# EAGLE design weather-bit (EAGLE 9.5.1)
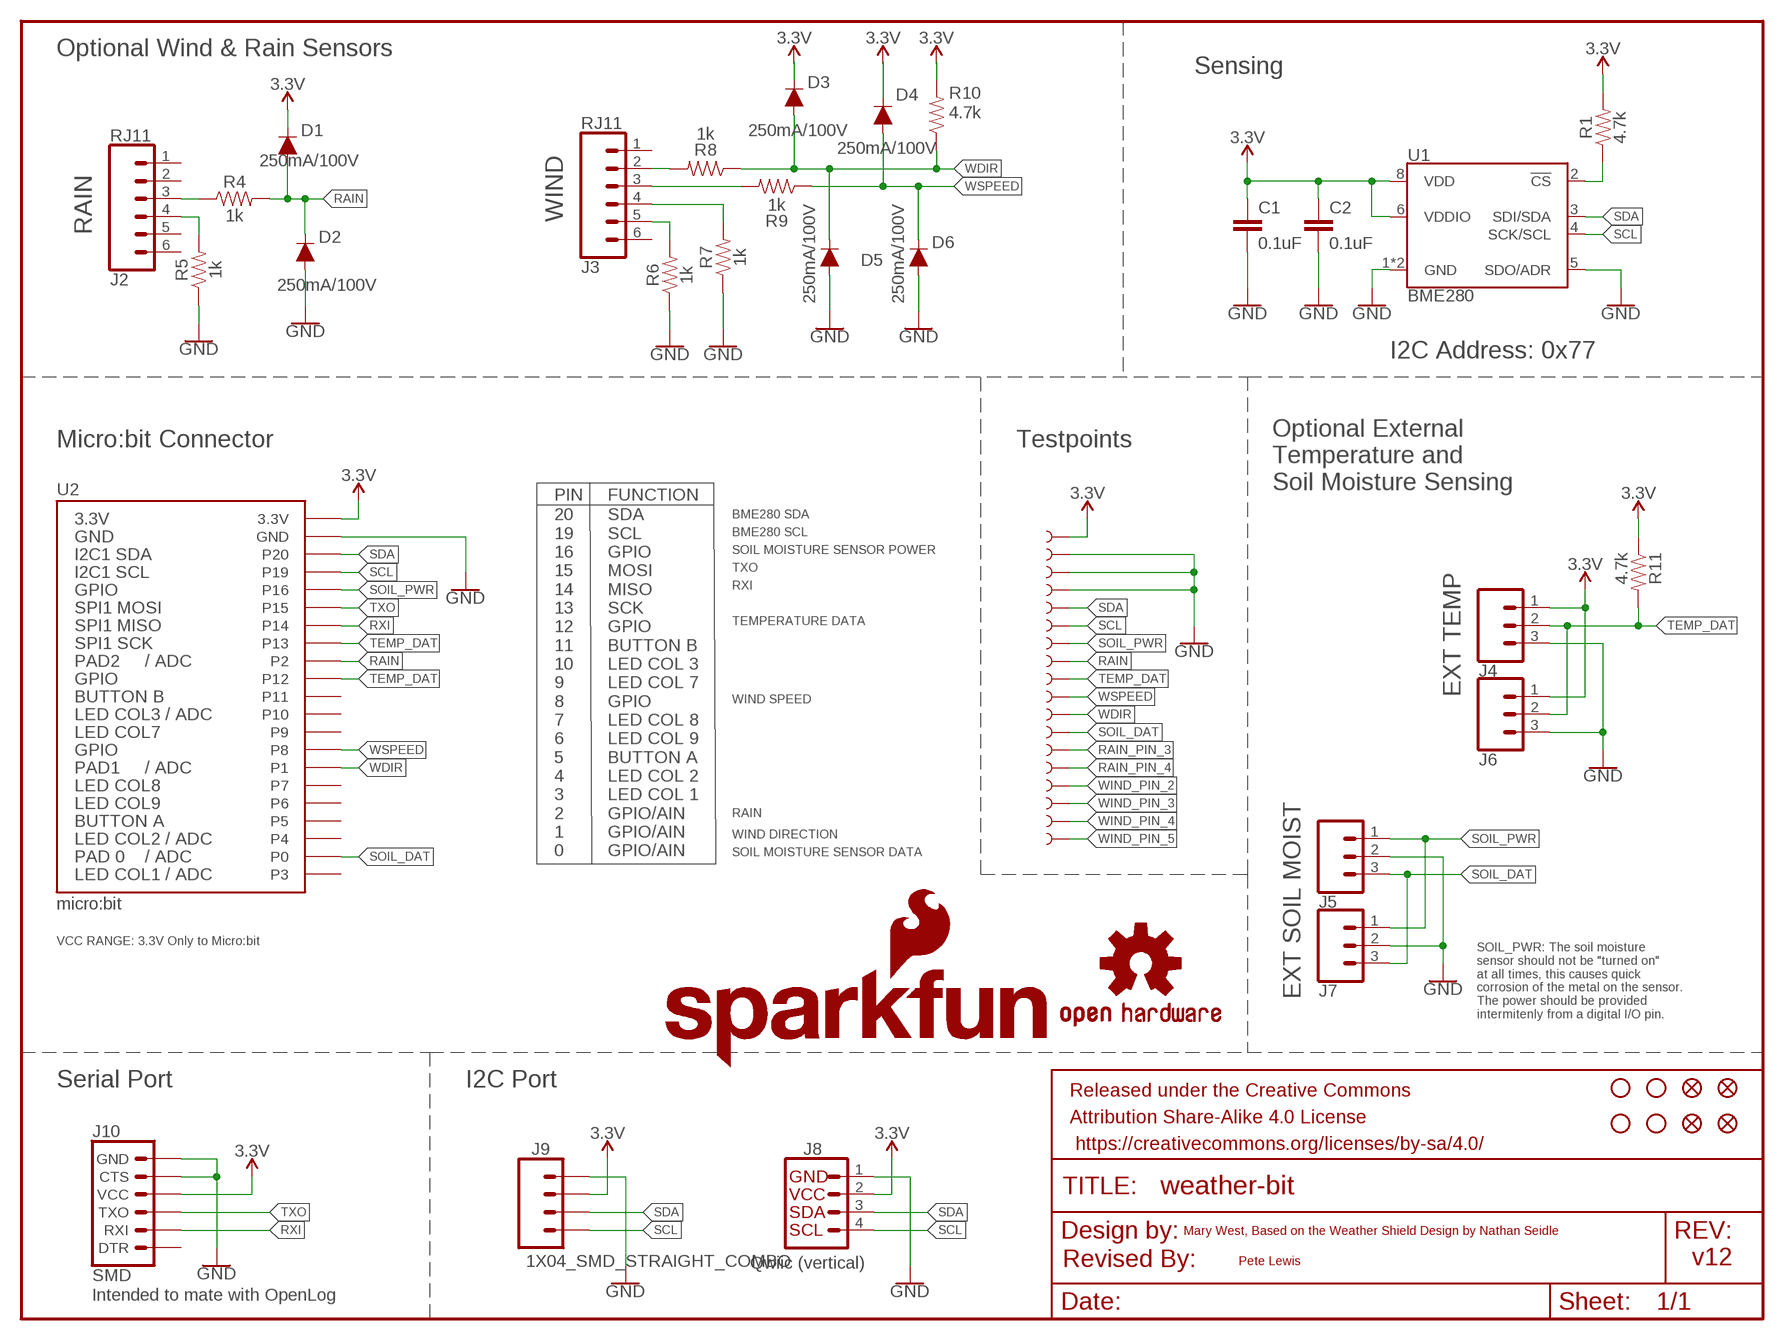
[diagram p0: schematic, sheet 1]

## Parts
C1  0.1uF  0.1UF-0603-25V-(+80/-20%)  [0603]
C2  0.1uF  0.1UF-0603-25V-(+80/-20%)  [0603]
D1  250mA/100V  DIODE-BAS16J  [SOD-323]
D2  250mA/100V  DIODE-BAS16J  [SOD-323]
D3  250mA/100V  DIODE-BAS16J  [SOD-323]
D4  250mA/100V  DIODE-BAS16J  [SOD-323]
D5  250mA/100V  DIODE-BAS16J  [SOD-323]
D6  250mA/100V  DIODE-BAS16J  [SOD-323]
FD1  FIDUCIAL1X2  [FIDUCIAL-1X2]
FD2  FIDUCIAL1X2  [FIDUCIAL-1X2]
FD3  FIDUCIAL1X2  [FIDUCIAL-1X2]
FD4  FIDUCIAL1X2  [FIDUCIAL-1X2]
FRAME1  FRAME-LETTER  [CREATIVE_COMMONS]
H1  STAND-OFF  [STAND-OFF]
H2  STAND-OFF  [STAND-OFF]
H3  STAND-OFF  [STAND-OFF]
H4  STAND-OFF  [STAND-OFF]
J2  RJ11  RJ11-6  [RJ11-6]
J3  RJ11  RJ11-6  [RJ11-6]
J4  CONN_03SCREW_LOCK  [SCREWTERMINAL-3.5MM-3_LOCK.007S]
J5  CONN_03SCREW_LOCK  [SCREWTERMINAL-3.5MM-3_LOCK.007S]
J6  CONN_03  [1X03]
J7  CONN_03  [1X03]
J8  Qwiic (vertical)  QWIIC_CONNECTOR  [JST04_1MM_VERT]
J9  1X04_SMD_STRAIGHT_COMBO  CONN_04SMD_STRAIGHT_COMBO  [1X04_SMD_VERTICAL_COMBO]
J10  SMD  6_PIN_SERIAL_TARGETVERT_SMT  [6_PIN_SERIAL_TARGET_SIDE_VERT_SMT]
LOGO2  SFE_LOGO_NAME_FLAME.3_INCH  [SFE_LOGO_NAME_FLAME_.3]
LOGO3  OSHW-LOGOL  [OSHW-LOGO-L]
R1  4.7k  4.7KOHM-0603-1/10W-1%  [0603]
R4  1k  1KOHM-0603-1/10W-1%  [0603]
R5  1k  1KOHM-0603-1/10W-1%  [0603]
R6  1k  1KOHM-0603-1/10W-1%  [0603]
R7  1k  1KOHM-0603-1/10W-1%  [0603]
R8  1k  1KOHM-0603-1/10W-1%  [0603]
R9  1k  1KOHM-0603-1/10W-1%  [0603]
R10  4.7k  4.7KOHM-0603-1/10W-1%  [0603]
R11  4.7k  4.7KOHM-0603-1/10W-1%  [0603]
TP1  TEST-POINTTP_15TH_THRU  [TP_15TH]
TP2  TEST-POINTTP_15TH_THRU  [TP_15TH]
TP3  TEST-POINTTP_15TH_THRU  [TP_15TH]
TP4  TEST-POINTTP_15TH_THRU  [TP_15TH]
TP5  TEST-POINTTP_15TH_THRU  [TP_15TH]
TP6  TEST-POINT3X4  [PAD.03X.04]
TP7  TEST-POINT3X4  [PAD.03X.04]
TP8  TEST-POINTTP_15TH_THRU  [TP_15TH]
TP9  TEST-POINTTP_15TH_THRU  [TP_15TH]
TP10  TEST-POINT3X4  [PAD.03X.04]
TP11  TEST-POINT3X4  [PAD.03X.04]
TP12  TEST-POINT3X4  [PAD.03X.04]
TP13  TEST-POINTTP_15TH_THRU  [TP_15TH]
TP14  TEST-POINTTP_15TH_THRU  [TP_15TH]
TP15  TEST-POINT3X4  [PAD.03X.04]
TP16  TEST-POINTTP_15TH_THRU  [TP_15TH]
TP17  TEST-POINTTP_15TH_THRU  [TP_15TH]
TP19  TEST-POINTTP_15TH_THRU  [TP_15TH]
U1  BME280  [LGA-8-2.5X2.5]
U2  micro:bit  MICRO:BIT_RA  [MICRO:BIT-RA_SMD]

## Nets
3.3V: C1.1 C2.1 D1.C D3.C D4.C J4.1 J6.1 J8.2 J9.3 J9.3-2 J10.4(VCC) J10.4-2(VCC) R1.2 R10.2 R11.1 TP1.P$1 U1.6(VDDIO) U1.8(VDD) U2.P$27(3.3V) U2.P$28(3.3V) U2.P$29(3.3V) U2.P$30(3.3V) U2.P$31(3.3V) U2.P$32(3.3V)
GND: C1.2 C2.2 D2.A D5.A D6.A J4.3 J5.2 J6.3 J7.2 J8.1 J9.4 J9.4-2 J10.5(CTS) J10.5-2(CTS) J10.6(GND) J10.6-2(GND) R5.1 R6.1 R7.1 TP2.P$1 TP16.P$1 TP17.P$1 U1.1(GND) U1.5(SDO/ADR) U1.7(GND) U2.P$35(GND) U2.P$36(GND) U2.P$37(GND) U2.P$38(GND) U2.P$39(GND) U2.P$40(GND)
N$2: R1.1 U1.2(!CS)
RAIN: D1.A D2.C R4.2 TP8.P$1 U2.P$19(P2) U2.P$20(P2) U2.P$21(P2) U2.P$22(P2)
RAIN_PIN_3: J2.3 R4.1 TP6.P$1
RAIN_PIN_4: J2.4 R5.2 TP7.P$1
RXI: J10.3(RXI) J10.3-2(RXI) U2.P$24(P14)
SCL: J8.4 J9.1 J9.1-2 TP4.P$1 U1.4(SCK/SCL) U2.P$33(P19)
SDA: J8.3 J9.2 J9.2-2 TP3.P$1 U1.3(SDI/SDA) U2.P$34(P20)
SOIL_DAT: J5.3 J7.3 TP19.P$1 U2.P$2(P0) U2.P$3(P0) U2.P$4(P0) U2.P$5(P0)
SOIL_PWR: J5.1 J7.1 TP5.P$1 U2.P$26(P16)
TEMP_DAT: J4.2 J6.2 R11.2 TP9.P$1 U2.P$18(P12) U2.P$23(P13)
TXO: J10.2(TXO) J10.2-2(TXO) U2.P$25(P15)
WDIR: D3.A D5.C R8.1 R10.1 TP14.P$1 U2.P$10(P1) U2.P$11(P1) U2.P$12(P1) U2.P$13(P1)
WIND_PIN_2: J3.2 R8.2 TP10.P$1
WIND_PIN_3: J3.3 R9.2 TP11.P$1
WIND_PIN_4: J3.4 R7.2 TP12.P$1
WIND_PIN_5: J3.5 R6.2 TP15.P$1
WSPEED: D4.A D6.C R9.1 TP13.P$1 U2.P$14(P8)
Unconnected: J2.1 J2.2 J2.5 J2.6 J3.1 J3.6 J10.1(DTR) J10.1-2(DTR) U2.P$1(P3) U2.P$6(P4) U2.P$7(P5) U2.P$8(P6) U2.P$9(P7) U2.P$15(P9) U2.P$16(P10) U2.P$17(P11)

## Notes on the sheet
- Optional Wind & Rain Sensors
- Sensing
- WIND
- RAIN
- I2C Address: 0x77
- Optional External 
  Temperature and 
  Soil Moisture Sensing
- Micro:bit Connector | Testpoints
- PIN | FUNCTION
- BME280 SDA
- BME280 SCL
- SOIL MOISTURE SENSOR POWER
- TXO
- RXI
- TEMPERATURE DATA
- EXT TEMP
- WIND SPEED
- RAIN
- WIND DIRECTION
- 20
  19
  16
  15
  14
  13
  12
  11
  10
  9
  8
  7
  6
  5
  4
  3
  2
  1
  0
- SDA
  SCL
  GPIO
  MOSI
  MISO
  SCK
  GPIO
  BUTTON B
  LED COL 3
  LED COL 7
  GPIO
  LED COL 8
  LED COL 9
  BUTTON A
  LED COL 2
  LED COL 1
  GPIO/AIN
  GPIO/AIN
  GPIO/AIN
- SOIL MOISTURE SENSOR DATA
- VCC RANGE: 3.3V Only to Micro:bit
- EXT SOIL MOIST
- SOIL_PWR: The soil moisture
  sensor should not be "turned on" 
  at all times, this causes quick
  corrosion of the metal on the sensor.
  The power should be provided 
  intermitenly from a digital I/O pin.
- Serial Port | I2C Port
- Mary West, Based on the Weather Shield Design by Nathan Seidle
- Revised By: | Pete Lewis | v12
- Intended to mate with OpenLog

## Library data of the parts
C1 C2 = SparkFun-Capacitors:0.1UF: 0.1µF ceramic capacitors A capacitor is a passive two-terminal electrical component used to store electrical energy temporarily in an electric field.; PROD_ID: CAP-00810
D1-D6 = SparkFun-DiscreteSemi:DIODE: Diode These are standard reverse protection diodes and small signal diodes. SparkFun Products: SparkFun SparkPunk Sound Kit <https://www.sparkfun.com/products/11177> SparkFun ESP8266 Thing <https://www.sparkfun.com/products/13231>; PROD_ID: DIO-09646
FD1-FD4 = SparkFun-Aesthetics:FIDUCIAL: Fiducial Alignment Points Point-of-reference for pick-and-place machines and other optical instruments.
FRAME1 = SparkFun-Aesthetics:FRAME-LETTER: Schematic Frame - Letter Standard 8.5x11 US Letter frame
H1-H4 = SparkFun-Electromechanical:STAND-OFF: #4 Stand Off This is the mechanical footprint for a #4 phillips button head screw. Use the keepout ring to avoid running the screw head into surrounding components. SKU : PRT-00447
J2 J3 = SparkFun-Connectors:RJ11-6: RJ11 Jack - 6 pin Commonly found on CAT3 devices and some Microchip programmers. Here is the connector we sell at SparkFun: RJ11 6-Pin Connector <https://www.sparkfun.com/products/132> (PRT-00132) Datasheet <http://www.sparkfun.com/datasheets/Prototyping/Connectors/RJ11-Datasheet.pdf> It is used on this SparkFun product: SparkFun Weather Shield <https://www.sparkfun.com/products/12081> (DEV-12081) Weather Meters <https://www.sparkfun.com/products/8942> (SEN-08942); PROD_ID: CONN-08590; SF_ID: PRT-00132
J4 J5 = SparkFun-Connectors:CONN_03: Multi connection point. Often used as Generic Header-pin footprint for 0.1 inch spaced/style header connections On any of the 0.1 inch spaced packages, you can populate with these: Break Away Headers - Straight <https://www.sparkfun.com/products/116> (PRT-00116) Break Away Male Headers - Right Angle <https://www.sparkfun.com/products/553> (PRT-00553) Female Headers <https://www.sparkfun.com/products/115> (PRT-00115) Break Away Headers - Machine Pin <https://www.sparkfun.com/products/117> (PRT-00117) Break Away Female Headers - Swiss Machine Pin <https://www.sparkfun.com/products/743> (PRT-00743) Stackable Header - 3 Pin (Female, 0.1") <https://www.sparkfun.com/products/13875> (PRT-13875) For SCREWTERMINALS and SPRING TERMINALS visit here: Screw Terimnals on SparkFun.com <https://www.sparkfun.com/search/results?term=Screw+Terminals> (5mm/3.5mm/2.54mm spacing) This device is also useful as a general connection point to wire up your design to another part of your project. Our various solder wires solder well into these plated through hole pads. Hook-Up Wire - Assortment (Stranded, 22 AWG) <https://www.sparkfun.com/products/11375> (PRT-11375) Hook-Up Wire - Assortment (Solid Core, 22 AWG) <https://www.sparkfun.com/products/11367> (PRT-11367) View the entire wire category on our website here <https://www.sparkfun.com/categories/141> Special notes: Molex polarized connector foot print use with SKU : PRT-08232 with associated crimp pins and housings.; PROD_ID: CONN-08288; SF_ID: PRT-08235
J6 J7 = SparkFun-Connectors:CONN_03: Multi connection point. Often used as Generic Header-pin footprint for 0.1 inch spaced/style header connections On any of the 0.1 inch spaced packages, you can populate with these: Break Away Headers - Straight <https://www.sparkfun.com/products/116> (PRT-00116) Break Away Male Headers - Right Angle <https://www.sparkfun.com/products/553> (PRT-00553) Female Headers <https://www.sparkfun.com/products/115> (PRT-00115) Break Away Headers - Machine Pin <https://www.sparkfun.com/products/117> (PRT-00117) Break Away Female Headers - Swiss Machine Pin <https://www.sparkfun.com/products/743> (PRT-00743) Stackable Header - 3 Pin (Female, 0.1") <https://www.sparkfun.com/products/13875> (PRT-13875) For SCREWTERMINALS and SPRING TERMINALS visit here: Screw Terimnals on SparkFun.com <https://www.sparkfun.com/search/results?term=Screw+Terminals> (5mm/3.5mm/2.54mm spacing) This device is also useful as a general connection point to wire up your design to another part of your project. Our various solder wires solder well into these plated through hole pads. Hook-Up Wire - Assortment (Stranded, 22 AWG) <https://www.sparkfun.com/products/11375> (PRT-11375) Hook-Up Wire - Assortment (Solid Core, 22 AWG) <https://www.sparkfun.com/products/11367> (PRT-11367) View the entire wire category on our website here <https://www.sparkfun.com/categories/141> Special notes: Molex polarized connector foot print use with SKU : PRT-08232 with associated crimp pins and housings.; PROD_ID: XXX-00000; VALUE: 455-1750-1-ND
J8 = SparkFun-Connectors:QWIIC_CONNECTOR: SparkFun I2C Standard Qwiic Connector An SMD 1mm pitch JST connector makes it easy and quick (get it? Qwiic?) to connect I2C devices to each other. The Qwiic system <http://www.sparkfun.com/qwiic> enables fast and solderless connection between popular platforms and various sensors and actuators. We carry 200mm <https://www.sparkfun.com/products/14204>, 100mm <https://www.sparkfun.com/products/14205>, 50mm <https://www.sparkfun.com/products/14206>, and breadboard friendly <https://www.sparkfun.com/products/14207> Qwiic cables. We also offer 10 pcs strips <https://www.sparkfun.com/products/14323> the SMD connectors.; PROD_ID: CONN-14483; VALUE: Vertical Qwiic Connector
J9 = SparkFun-Connectors:CONN_04: Multi connection point. Often used as Generic Header-pin footprint for 0.1 inch spaced/style header connections On any of the 0.1 inch spaced packages, you can populate with these: Break Away Headers - Straight <https://www.sparkfun.com/products/116> (PRT-00116) Break Away Male Headers - Right Angle <https://www.sparkfun.com/products/553> (PRT-00553) Female Headers <https://www.sparkfun.com/products/115> (PRT-00115) Break Away Headers - Machine Pin <https://www.sparkfun.com/products/117> (PRT-00117) Break Away Female Headers - Swiss Machine Pin <https://www.sparkfun.com/products/743> (PRT-00743) For SCREWTERMINALS and SPRING TERMINALS visit here: Screw Terimnals on SparkFun.com <https://www.sparkfun.com/search/results?term=Screw+Terminals> (5mm/3.5mm/2.54mm spacing) This device is also useful as a general connection point to wire up your design to another part of your project. Our various solder wires solder well into these plated through hole pads. Hook-Up Wire - Assortment (Stranded, 22 AWG) <https://www.sparkfun.com/products/11375> (PRT-11375) Hook-Up Wire - Assortment (Solid Core, 22 AWG) <https://www.sparkfun.com/products/11367> (PRT-11367) View the entire wire category on our website here <https://www.sparkfun.com/categories/141> Special notes: Molex polarized connector foot print use with SKU : PRT-08231 with associated crimp pins and housings. 1MM SMD Version SKU: PRT-10208; PROD_ID: CONN-08511
J10 = SparkFun-Connectors:6_PIN_SERIAL_TARGET: 6-pin header connection for use with the "FTDI BASIC" pinout - TARGET SIDE. Also known as "Arduino Serial Program Header". It is used to mate with our FTDI Basic serial programmers using the Arduino IDE. Note, this device has "TARGET" in the name. It is intended to be used on a design that contains a target micro-controller that you wish to program. The "sister" device, named "CABLE" is inteneded to be used on a design that usually lives on the end of your USB cable and prvides the converter chip (FTDI232 or FTDI231x) to commnicate serial RX/TX. You can populate with some of these: Break Away Headers - Straight <https://www.sparkfun.com/products/116> (PRT-00116) For reference (or to suit your programming needs) check out these designs: SparkFun FTDI Basic Breakout - 5V <https://www.sparkfun.com/products/9716> (DEV-09716) SparkFun FTDI Basic Breakout - 3.3V <https://www.sparkfun.com/products/9873> (DEV-09873) SparkFun FTDI SmartBasic <https://www.sparkfun.com/products/12935> (DEV-12935) SparkFun Beefy 3 - FTDI Basic Breakout <https://www.sparkfun.com/products/13746> (DEV-13746); PROD_ID: CONN-10203
LOGO2 = SparkFun-Aesthetics:SFE_LOGO_NAME_FLAME: SparkFun Font Logo w/ Flame This is the SparkFun full logo. The logo on the schematic will always be the same size; the package variant is the height of the flame part of the logo. Default layer for the logo on the board is tSilk.
LOGO3 = SparkFun-Aesthetics:OSHW-LOGO: Open-Source Hardware (OSHW) Logo This logo indicates the piece of hardware it is found on incorporates a OSHW license and/or adheres to the definition of open source hardware found here: http://freedomdefined.org/OSHW
R1 R10 R11 = SparkFun-Resistors:4.7KOHM: 4.7kΩ resistor A resistor is a passive two-terminal electrical component that implements electrical resistance as a circuit element. Resistors act to reduce current flow, and, at the same time, act to lower voltage levels within circuits. - Wikipedia; PROD_ID: RES-07857
R4-R9 = SparkFun-Resistors:1KOHM: 1kΩ resistor A resistor is a passive two-terminal electrical component that implements electrical resistance as a circuit element. Resistors act to reduce current flow, and, at the same time, act to lower voltage levels within circuits. - Wikipedia; PROD_ID: RES-07856
TP1-TP17 TP19 = SparkFun-Connectors:TEST-POINT: SparkFun Test Points Bare copper test points for troubleshooting or In-Circuit-Testing. These are used by our Production team for verifying production board runs using pogo-pins on test beds. SparkFun Products: SparkFun LSM9DS1 Breakout <https://www.sparkfun.com/products/13284> SparkFun PSOC <https://www.sparkfun.com/products/13714> SparkFun Load Cell Amplifier <https://www.sparkfun.com/products/13879>
U1 = SparkFun-Sensors:BME280: Bosch BME280 – Combined Humidity and Pressure Sensor The BME280 is as combined digital humidity, pressure and temperature sensor based on proven sensing principles. The sensor module is housed in an extremely compact metal-lid LGA package with a footprint of only 2.5×2.5mm² with a height of 0.93mm. Its small dimensions and its low power consumption allow the implementation in battery driven devices such as handsets, GPS modules or watches. Datasheet <https://cdn.sparkfun.com/assets/learn_tutorials/4/1/9/BST-BME280_DS001-10.pdf> SparkFun Products SparkFun Atmospheric Sensor Breakout - BME280 <https://www.sparkfun.com/products/13676> (SEN-13676); PROD_ID: IC-13090
U2 = SparkFun-Connectors:MICRO:BIT*?; PROD_ID: CONN-14679

## Board
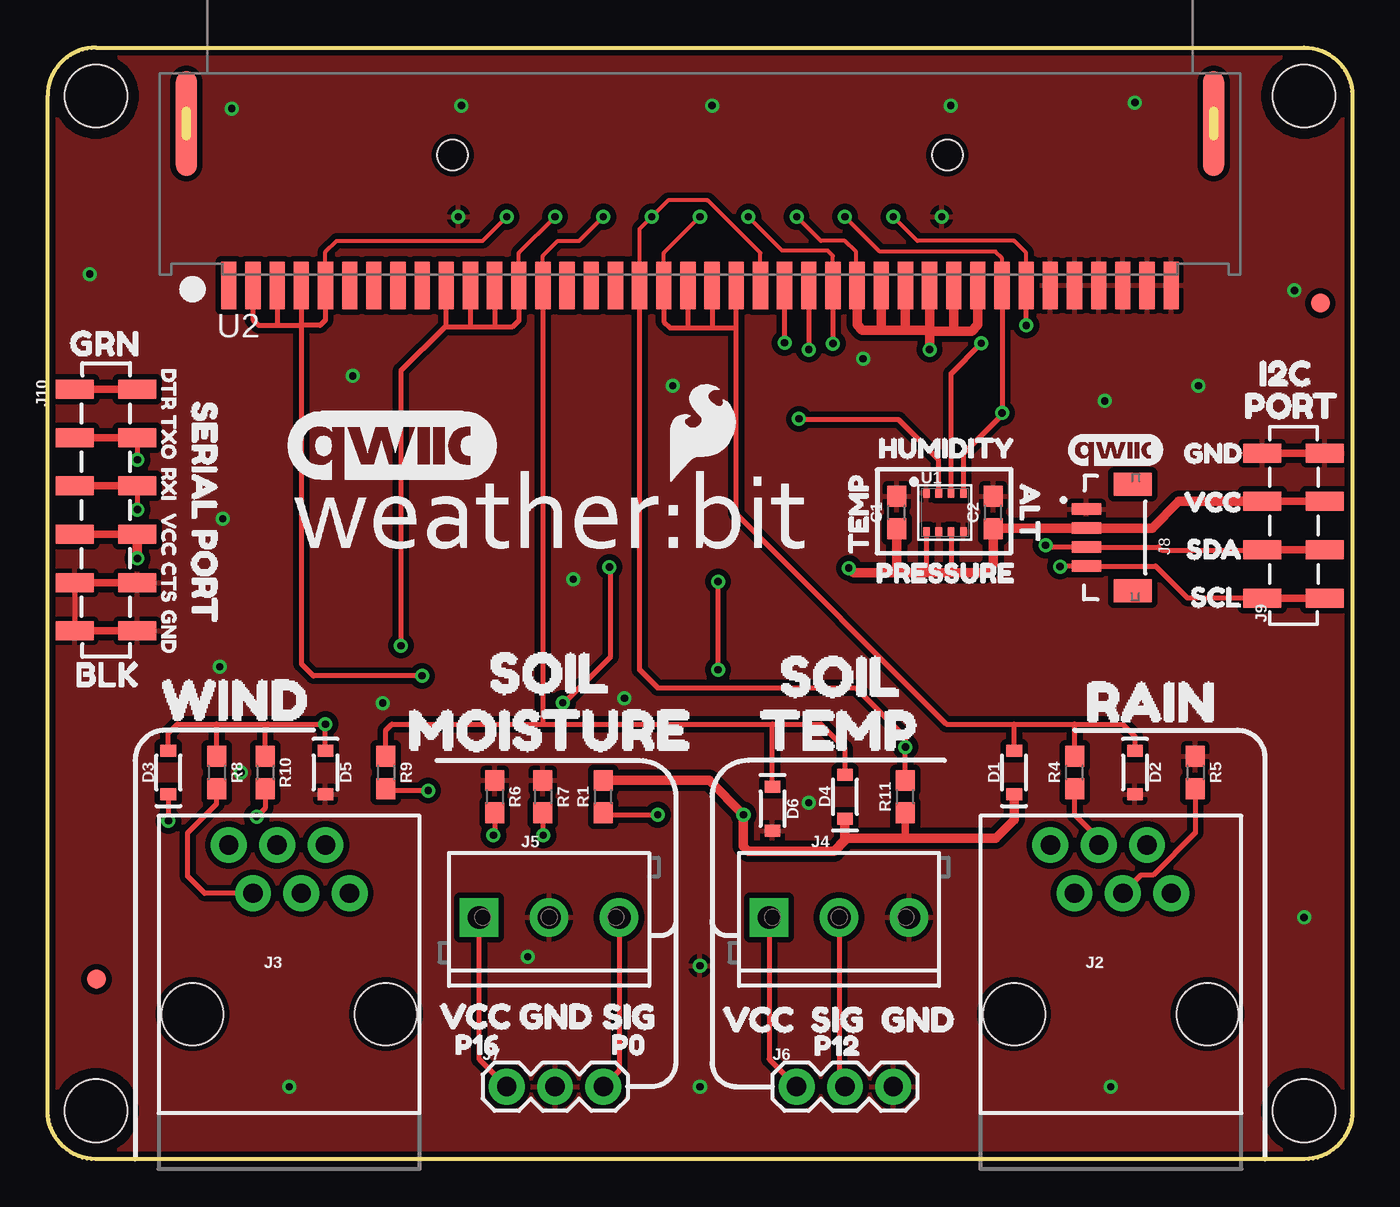
[diagram p1: board, top side]
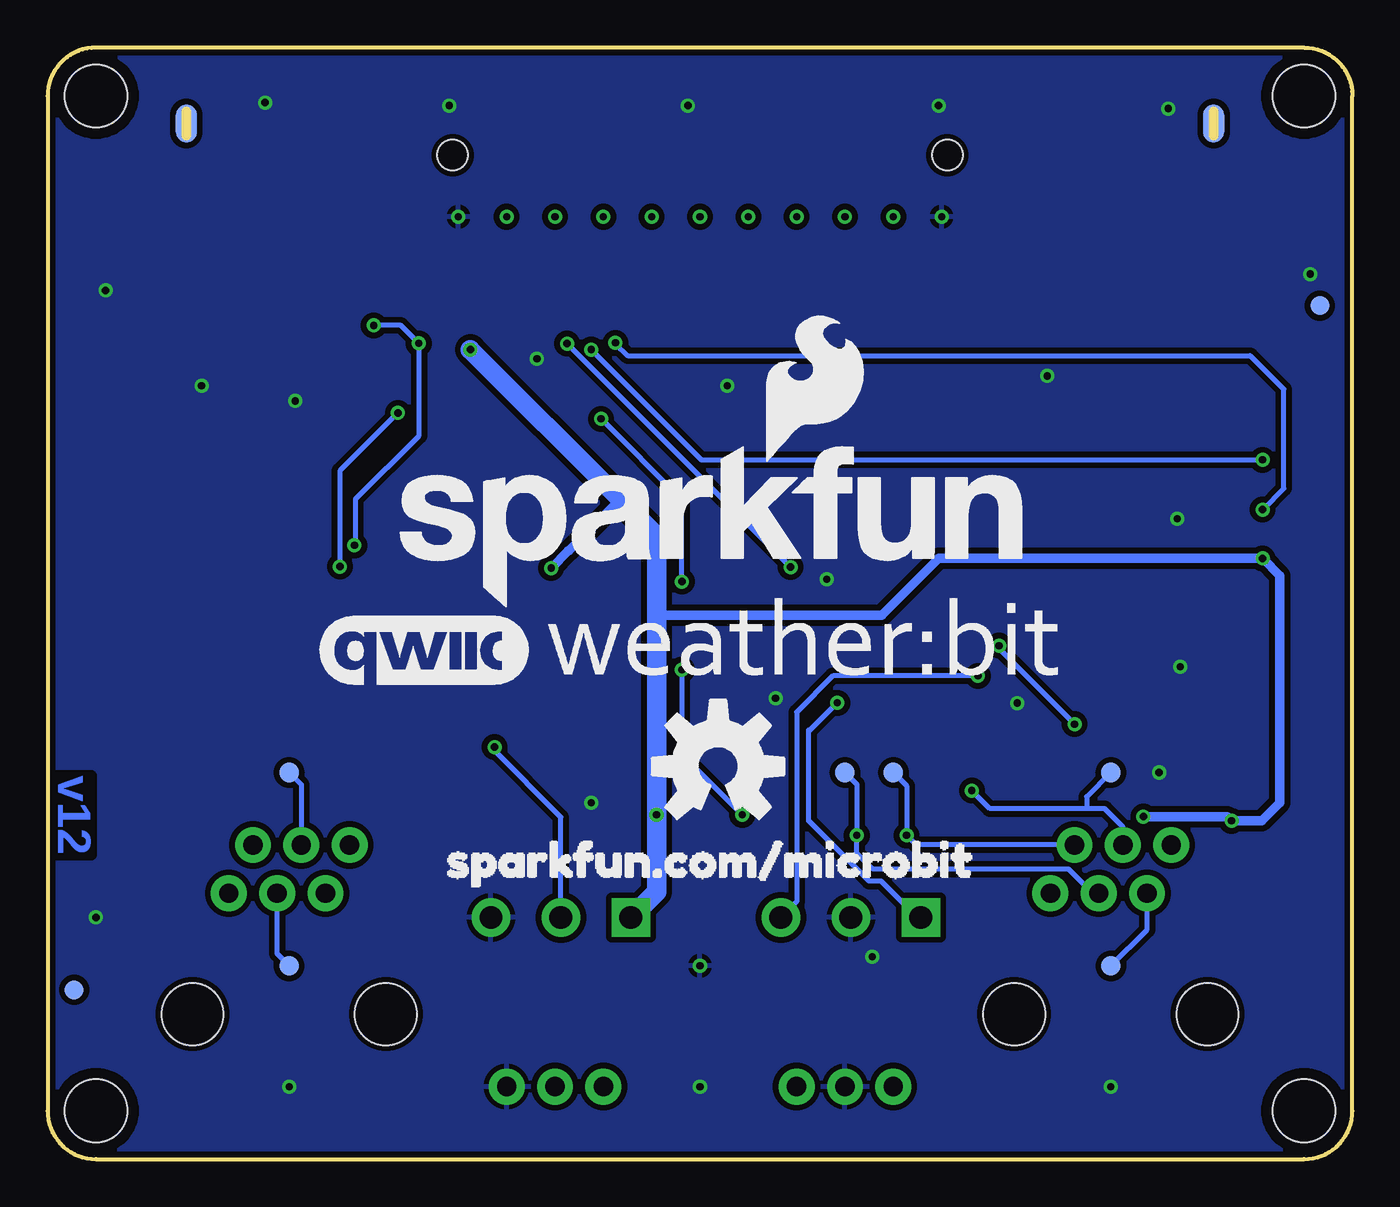
[diagram p2: board, bottom side, seen from below]

Size 68.58 x 58.42 mm. Coordinates in mm from the lower left corner, seen from the top.
Outline: 2.54,58.42 66.04,58.42 arc-90 68.58,55.88 68.58,2.54 arc-90 66.04,0 2.54,0 arc-90 0,2.54 0,55.88 arc-90 2.54,58.42
Copper layers (1*16): Top 0.035mm / dielectric 1.5mm / Bottom 0.035mm
Design rules "SparkFun-2-layer-TIGHT": minimum track width 7mil, minimum drill 15mil, track to track 7mil, track to pad 7mil, pad to pad 7mil, via to via 7mil, smd to smd 7mil, copper to edge 7mil, drill to drill 7mil, minimum pad ring 7mil, minimum via ring 7mil, stop-mask expansion 4mil, vias tented up to drill 25mil, thermal gap 10mil

### Footprints (pad centres in the part's own frame; a part is rotated, then mirrored left to right if it is on the bottom)
0603 = smd 1.1 x 1: 1 -0.85,0; 2 0.85,0
SOD-323 = smd 0.63 x 0.83: A 1.15,0; C -1.15,0
FIDUCIAL-1X2 = smd 1 x 1: 1 0,0
STAND-OFF = hole 3.302: 0,0
RJ11-6 = drill 1.016 pad 1.88: 1 -3.175,8.89; 2 -1.905,6.35; 3 -0.635,8.89; 4 0.635,6.35; 5 1.905,8.89; 6 3.175,6.35 | hole 3.251: -5.08,0; 5.08,0
SCREWTERMINAL-3.5MM-3_LOCK.007S = drill 1.2 pad 2.032 square: 1 -0.178,0 | drill 1.2 pad 2.032: 2 3.5,0; 3 7.178,0
1X03 = drill 1.016 pad 1.88: 1 0,0; 2 2.54,0; 3 5.08,0
JST04_1MM_VERT = smd 0.6 x 1.55: 1 -1.478,0.775; 2 -0.478,0.775; 3 0.522,0.775; 4 1.522,0.775 | smd 1.2 x 2: NC1 -2.778,3.2; NC2 2.822,3.2
1X04_SMD_VERTICAL_COMBO = smd 1 x 2: 1 0,-1.65; 1-2 0,1.65; 2 2.54,1.65; 2-2 2.54,-1.65; 3 5.08,-1.65; 3-2 5.08,1.65; 4 7.62,1.65; 4-2 7.62,-1.65
6_PIN_SERIAL_TARGET_SIDE_VERT_SMT = smd 1 x 2: 1 0,-1.65; 1-2 0,1.65; 2 2.54,1.65; 2-2 2.54,-1.65; 3 5.08,-1.65; 3-2 5.08,1.65; 4 7.62,1.65; 4-2 7.62,-1.65; 5 10.16,-1.65; 5-2 10.16,1.65; 6 12.7,1.65; 6-2 12.7,-1.65
TP_15TH = drill 0.381 pad 0.61: P$1 0,0
PAD.03X.04 = smd 1.016 x 1.016: P$1 0,0
LGA-8-2.5X2.5 = smd 0.35 x 0.5: 1 -0.975,1.025; 2 -0.325,1.025; 3 0.325,1.025; 4 0.975,1.025; 5 0.975,-1.025; 6 0.325,-1.025; 7 -0.325,-1.025; 8 -0.975,-1.025
MICRO:BIT-RA_SMD = smd 0.8 x 2.5: P$1 -24.765,-6.15; P$2 -23.495,-6.15; P$3 -22.225,-6.15; P$4 -20.955,-6.15; P$5 -19.685,-6.15; P$6 -18.415,-6.15; P$7 -17.145,-6.15; P$8 -15.875,-6.15; P$9 -14.605,-6.15; P$10 -13.335,-6.15; P$11 -12.065,-6.15; P$12 -10.795,-6.15; P$13 -9.525,-6.15; P$14 -8.255,-6.15; P$15 -6.985,-6.15; P$16 -5.715,-6.15; P$17 -4.445,-6.15; P$18 -3.175,-6.15; P$19 -1.905,-6.15; P$20 -0.635,-6.15; P$21 0.635,-6.15; P$22 1.905,-6.15; P$23 3.175,-6.15; P$24 4.445,-6.15; P$25 5.715,-6.15; P$26 6.985,-6.15; P$27 8.255,-6.15; P$28 9.525,-6.15; P$29 10.795,-6.15; P$30 12.065,-6.15; P$31 13.335,-6.15; P$32 14.605,-6.15; P$33 15.875,-6.15; P$34 17.145,-6.15; P$35 18.415,-6.15; P$36 19.685,-6.15; P$37 20.955,-6.15; P$38 22.225,-6.15; P$39 23.495,-6.15; P$40 24.765,-6.15 | smd 1.1 x 5.5: P$42 -27,2.36; P$43 27,2.36 | smd 1.1 x 2 bottom: P$44 -27,2.36; P$45 27,2.36 | hole 1.6: 13,0.7; -13,0.7

### Placement (x,y rotation side)
C1  44.62,33.99 90 top
C2  49.7,33.99 90 top
D1  50.8,20.32 90 top
D2  57.15,20.32 270 top
D3  6.35,20.32 90 top
D4  41.91,19.05 90 top
D5  14.61,20.32 270 top
D6  38.1,18.41 270 top
FD1  2.57,9.46 0 top
FD2  66.9,44.99 0 top
FD3  1.71,44.86 0 bottom
FD4  67.18,8.89 0 bottom
FRAME1  0,-11.43 0 top  (outside the outline)
H1  2.54,55.88 0 top
H2  66.04,55.88 0 top
H3  2.54,2.54 0 top
H4  66.04,2.54 0 top
J2  55.88,7.62 0 top
J3  12.7,7.62 0 top
J4  38.1,12.7 0 top
J5  22.86,12.7 0 top
J6  39.37,3.81 0 top
J7  24.13,3.81 0 top
J8  53.82,32.69 270 top
J9  65.48,29.49 90 top
J10  3.07,40.46 270 top
LOGO2  50.64,28.89 0 bottom
LOGO3  33.34,20.64 0 bottom
R1  29.21,19.05 90 top
R4  53.98,20.32 90 top
R5  60.33,20.32 270 top
R6  23.5,19.05 270 top
R7  26.04,19.05 270 top
R8  8.89,20.32 270 top
R9  17.78,20.32 270 top
R10  11.43,20.32 270 top
R11  45.09,19.05 90 top
TP1  39.37,49.53 90 top
TP2  46.99,49.53 90 top
TP3  44.45,49.53 90 top
TP4  41.91,49.53 90 top
TP5  36.83,49.53 90 top
TP6  55.88,20.32 0 bottom
TP7  55.88,10.16 0 bottom
TP8  34.29,49.53 90 top
TP9  31.75,49.53 90 top
TP10  12.7,10.16 0 bottom
TP11  12.7,20.32 0 bottom
TP12  26.67,20.32 0 bottom
TP13  29.21,49.53 90 top
TP14  26.67,49.53 90 top
TP15  24.13,20.32 0 bottom
TP16  21.59,49.53 0 top
TP17  34.29,10.16 0 top
TP19  24.13,49.53 90 top
U1  47.16,33.99 0 top
U2  34.29,52.07 0 top
U$1  [SFE_LOGO_FLAME_.2]  32.4,35.35 0 top
U$2  [LOGO-WEATHERBIT]  12.8,31.88 0 top
U$3  [LOGO-WEATHERBIT]  42.44,25.22 0 bottom
U$4  [ORDERING_INSTRUCTIONS]  1.14,-16.64 0 top  (outside the outline)
U$5  [QWIIC_5MM]  56.11,37.29 0 top
U$6  [QWIIC_11MM]  18.14,37.47 0 top
U$7  [QWIIC_11MM]  48.77,26.7 0 bottom
U$8  [I2C1]  62.51,41.3 0 top
U$9  [PORT2]  61.75,39.6 0 top
U$10  [SERIAL_PORT0]  8.26,40.94 270 top
U$11  [WIND12]  4.19,24.13 0 top
U$12  [SOIL13]  21.36,25.55 0 top
U$13  [SOIL13]  36.65,25.37 0 top
U$14  [MOISTURE14]  17.09,22.56 0 top
U$15  [TEMP15]  35.61,22.53 0 top
U$16  [RAIN16]  52.73,24.03 0 top
U$17  [VCC6]  19.51,7.52 0 top
U$18  [GND7]  23.67,7.52 0 top
U$19  [SIG8]  28.04,7.49 0 top
U$20  [SIG8]  38.99,7.34 0 top
U$21  [VCC6]  34.39,7.34 0 top
U$22  [GND7]  42.7,7.34 0 top
U$23  [P169]  20.5,6.02 0 top
U$24  [P010]  28.73,6.02 0 top
U$25  [P1211]  39.37,5.97 0 top
U$26  [HUMIDITY3]  42.75,37.36 0 top
U$27  [TEMP4]  42.62,30.91 90 top
U$28  [PRESSURE5]  42.62,30.81 0 top
U$29  [GND18]  58.83,37.11 0 top
U$30  [VCC19]  58.85,34.54 0 top
U$31  [SDA20]  58.95,32.05 0 top
U$32  [SCL21]  59.18,29.54 0 top
U$33  [SPARKFUN#COM#MICROBIT17]  49.17,15.72 0 bottom
U$34  [ALT0]  51.64,36.37 270 top

### Tracks (layer width: path | path; a pad name or v marks a point on that pad's centre or on a via)
3.3V  (via drill 0.38)
  Top 0.203: U2.P$27 42.49,45.97 42.49,47.68 41.91,48.26 40.64,48.26 TP1.P$1
  Top 0.254: J4.1 37.92,5.26 J6.1 | D3.C v6.35,17.78 | R10.2 11.43,18.45 v10.99,18 | 42.01,16.86 41.91,16.76 | U1.6 47.49,30.82 47.47,30.81 | U1.8 46.19,30.83 46.2,30.81 | J10.4 J10.4-2 | J9.3-2 J9.3
  Top 0.406: R11.1 45.09,16.86
  Top 0.508: R1.2 34.77,19.9 v36.58,18.1 36.58,16.45 36.83,16.19 41.34,16.19 41.91,16.76 | D1.C 50.8,17.83 49.83,16.86 45.09,16.86 42.01,16.86 41.91,16.95 D4.C | v42.11,31.06 42.37,30.81 44.63,30.81 | U2.P$30 46.35,43.56 | 46.35,43.56 v46.35,42.55 | U2.P$27 42.55,43.84 42.82,43.56 43.81,43.56 | 43.81,43.56 45.09,43.56 | 45.09,43.56 46.35,43.56 | U2.P$32 48.9,43.84 48.56,43.51 47.62,43.51 | 47.62,43.51 46.41,43.51 46.35,43.56 | U2.P$31 47.62,43.51 | U2.P$29 45.09,43.56 | U2.P$28 43.81,43.56 | 44.63,30.81 46.2,30.81 47.47,30.81 49.25,30.81 49.72,31.27 49.7,31.29 C2.1 49.73,33.17 J8.2 58.06,33.17 59.46,34.57 J9.3-2 | C1.1 44.62,30.82 44.63,30.81 | J10.4 v4.72,31.57
  Bottom 0.508: v10.99,18 6.57,18 v6.35,17.78 4.76,17.78 3.81,18.73 3.81,30.66 v4.72,31.57 21.74,31.57 24.74,28.57 36.26,28.57 36.58,28.89 | v42.11,31.06 41.21,31.97 41.2,31.97 38.49,34.68
  Bottom 1.016: J4.1 36.58,14.05 v36.58,18.1 36.58,28.89 36.58,32.77 38.49,34.68 v46.35,42.55
GND  (via drill 0.38)
  Top 0.254: J10.5-2 J10.5 J10.6-2 | J9.4 J9.4-2
  other vias: 9.68,55.21 57.15,55.53 47.47,55.37 34.92,55.37 21.75,55.37 34.29,3.81 55.56,39.85 32.86,40.64 27.62,30.48 66.04,12.7 65.53,45.66 9.21,33.66 9.05,25.88 2.22,46.51 16.03,41.16 17.62,23.97 25.24,10.64 30.32,24.23 40.01,18.73 10.16,20.32 12.7,3.81 60.48,40.64 42.86,42.07 55.88,3.81
  pour Top (isolate 0.305): 0,58.42 -0.14,-0.32 68.44,-0.32 68.58,58.42
  pour Bottom (isolate 0.305): 0,58.42 -0.14,-0.32 68.44,-0.32 68.58,58.42
N$2  (via drill 0.38)
  Top 0.254: v35.24,25.72 v35.24,30.35 | R1.1 29.21,18.1 v32.07,18.1 | U1.2 46.84,36.76 44.73,38.86 39.53,38.86 v39.49,38.91
  Bottom 0.254: v35.24,30.35 35.24,34.66 v39.49,38.91 | v35.24,25.72 35.24,21.27 v32.07,18.1
RAIN
  Top 0.203: U2.P$19 32.38,47.62 TP8.P$1
  Top 0.254: 50.8,22.86 53.98,22.86 | 53.98,22.86 56.52,22.86 57.15,22.23 D2.C | R4.2 53.98,22.86 | D1.A 50.8,22.86 | 50.8,22.86 47.24,22.86 36.2,33.91 36.2,43.69 | 36.2,43.69 U2.P$22 | U2.P$19 32.38,44.02 32.72,43.69 33.66,43.69 | 33.66,43.69 34.92,43.69 | 34.92,43.69 36.2,43.69 | U2.P$20 33.66,43.69 | U2.P$21 34.92,43.69
RAIN_PIN_3
  Top 0.254: J2.3 55.24,16.83 53.98,18.1 R4.1
  Bottom 0.254: TP6.P$1 55.24,19.68 J2.3
RAIN_PIN_4
  Top 0.254: R5.2 60.33,17.14 58.1,14.92 57.47,14.92 J2.4
  Bottom 0.254: TP7.P$1 56.52,10.79 J2.4
RXI  (via drill 0.38)
  Top 0.254: v38.73,42.9 U2.P$24 | J10.3 J10.3-2 v4.72,34.14
  Bottom 0.254: v38.73,42.9 38.73,42.86 38.1,42.23 5.37,42.23 3.61,40.46 3.61,35.26 v4.72,34.14
SCL  (via drill 0.38)
  Top 0.203: U2.P$33 50.16,47.35 49.81,47.7 43.74,47.7 TP4.P$1
  Top 0.254: U2.P$33 v50.16,39.22 50.16,39.12 48.13,37.08 U1.4 | v53.21,31.14 53.24,31.17 J8.4 58.24,31.17 59.92,29.49 J9.1-2 J9.1
  Bottom 0.254: v50.16,39.22 53.21,36.17 v53.21,31.14
SDA  (via drill 0.38)
  Top 0.203: U2.P$34 51.44,47.62 50.8,48.26 45.72,48.26 TP3.P$1
  Top 0.254: v49.07,42.88 47.49,41.29 U1.3 | v51.44,43.81 U2.P$34 | v52.45,32.26 52.54,32.17 J8.3 58.38,32.17 58.55,32 63.81,32 J9.2 J9.2-2
  Bottom 0.254: v51.44,43.81 50.01,43.81 v49.07,42.88 49.05,42.85 49.05,38.02 52.4,34.67 52.4,32.31 v52.45,32.26
SOIL_DAT  (via drill 0.38)
  Top 0.203: U2.P$5 14.61,47.68 15.19,48.26 22.86,48.26 TP19.P$1
  Top 0.254: J5.3 30.04,4.64 J7.3 | v19.68,25.4 13.97,25.4 13.34,26.04 13.34,43.81 | U2.P$4 13.34,43.81 | U2.P$5 14.61,44.09 14.33,43.81 13.34,43.81 | U2.P$2 10.79,44.12 11.1,43.81 12.06,43.81 | 12.06,43.81 13.34,43.81 | U2.P$3 12.06,43.81
  Bottom 0.254: v19.68,25.4 27.3,25.4 29.21,23.5 29.21,13.53 J5.3
SOIL_PWR  (via drill 0.38)
  Top 0.203: U2.P$26 41.27,47.47 41,47.75 38.61,47.75 TP5.P$1
  Top 0.254: J7.1 22.68,5.26 J5.1 | v29.53,31.11 29.59,31.05 29.59,26.42 27.12,23.94 v27.08,23.98 | U2.P$26 v41.27,42.86
  Bottom 0.254: v29.53,31.11 v41.27,42.86 | J5.1 22.86,12.7 24.77,14.61 25.4,14.61 28.57,17.78 28.57,22.54 28.51,22.54 v27.08,23.98
TEMP_DAT  (via drill 0.38)
  Top 0.203: U2.P$18 31.11,48.9 TP9.P$1 32.61,50.39 34.7,50.39 37.47,47.62 U2.P$23
  Top 0.254: J4.2 41.6,4.12 J6.2 | R11.2 v45.09,21.65 45.09,22.16 42.48,24.77 32.07,24.77 31.11,25.72 U2.P$18
  Bottom 0.254: J4.2 41.6,17.98 45.18,21.56 v45.09,21.65
TXO  (via drill 0.38)
  Top 0.254: U2.P$25 v40.01,42.55 | v4.72,36.75 J10.2 J10.2-2
  Bottom 0.254: v4.72,36.75 34.21,36.75 v40.01,42.55
WDIR  (via drill 0.38)
  Top 0.203: U2.P$13 24.77,47.62 TP14.P$1
  Top 0.254: 20.87,43.73 18.57,41.43 v18.57,26.99 | 20.87,43.73 20.95,43.81 U2.P$10 | D3.A 6.35,22.38 6.83,22.86 8.89,22.86 | 8.89,22.86 11.59,22.86 | 11.59,22.86 v14.61,22.86 D5.C | R8.1 8.89,22.86 | R10.1 11.43,22.7 11.59,22.86 | U2.P$13 24.77,44.07 24.42,43.73 23.5,43.73 | 23.5,43.73 22.23,43.73 | 22.23,43.73 20.87,43.73 | U2.P$11 22.23,43.73 | U2.P$12 23.5,43.73
  Bottom 0.254: v18.57,26.99 18.57,26.83 v14.61,22.86
WIND_PIN_2
  Top 0.254: J3.2 8.26,13.97 7.37,14.86 7.37,17.14 8.89,18.67 R8.2
  Bottom 0.254: J3.2 10.79,12.06 TP10.P$1
WIND_PIN_3  (via drill 0.38)
  Top 0.254: v20,19.37 17.88,19.37 R9.2
  Bottom 0.254: J3.3 12.06,17.46 13.02,18.41 13.97,18.41 | 13.97,18.41 19.05,18.41 v20,19.37 | TP11.P$1 13.97,19.05 13.97,18.41
WIND_PIN_4  (via drill 0.38)
  Top 0.254: R7.2 26.04,17.03 v26.05,17.02
  Bottom 0.254: J3.4 13.65,13.97 14.92,15.24 25.21,15.24 25.82,15.85 26.05,16.08 v26.05,17.02 26.05,19.7 TP12.P$1
WIND_PIN_5  (via drill 0.38)
  Top 0.254: R6.2 23.5,17.08 v23.43,17.02
  Bottom 0.254: J3.5 22.92,16.51 v23.43,17.02 23.43,19.62 TP15.P$1
WSPEED
  Top 0.203: U2.P$14 26.04,47.47 26.82,48.26 27.94,48.26 TP13.P$1
  Top 0.254: R9.1 17.78,22.54 18.1,22.86 26.04,22.86 | 26.04,22.86 38.1,22.86 | 38.1,22.86 40.64,22.86 41.91,21.59 D4.A | D6.C 38.1,22.86 | U2.P$14 26.04,22.86

### Text on the board
Bottom: v12
Measures: * All dimensions / are in inches
tDocu: Mary West, based on Weather Shield Design by Nathan Seidle | Revised by: | Pete Lewis | Solder Mask: Black Gloss